# Altium schematic sheet etb_driver.SchDoc
size A4; SheetNumber: 4; SheetTotal: 8
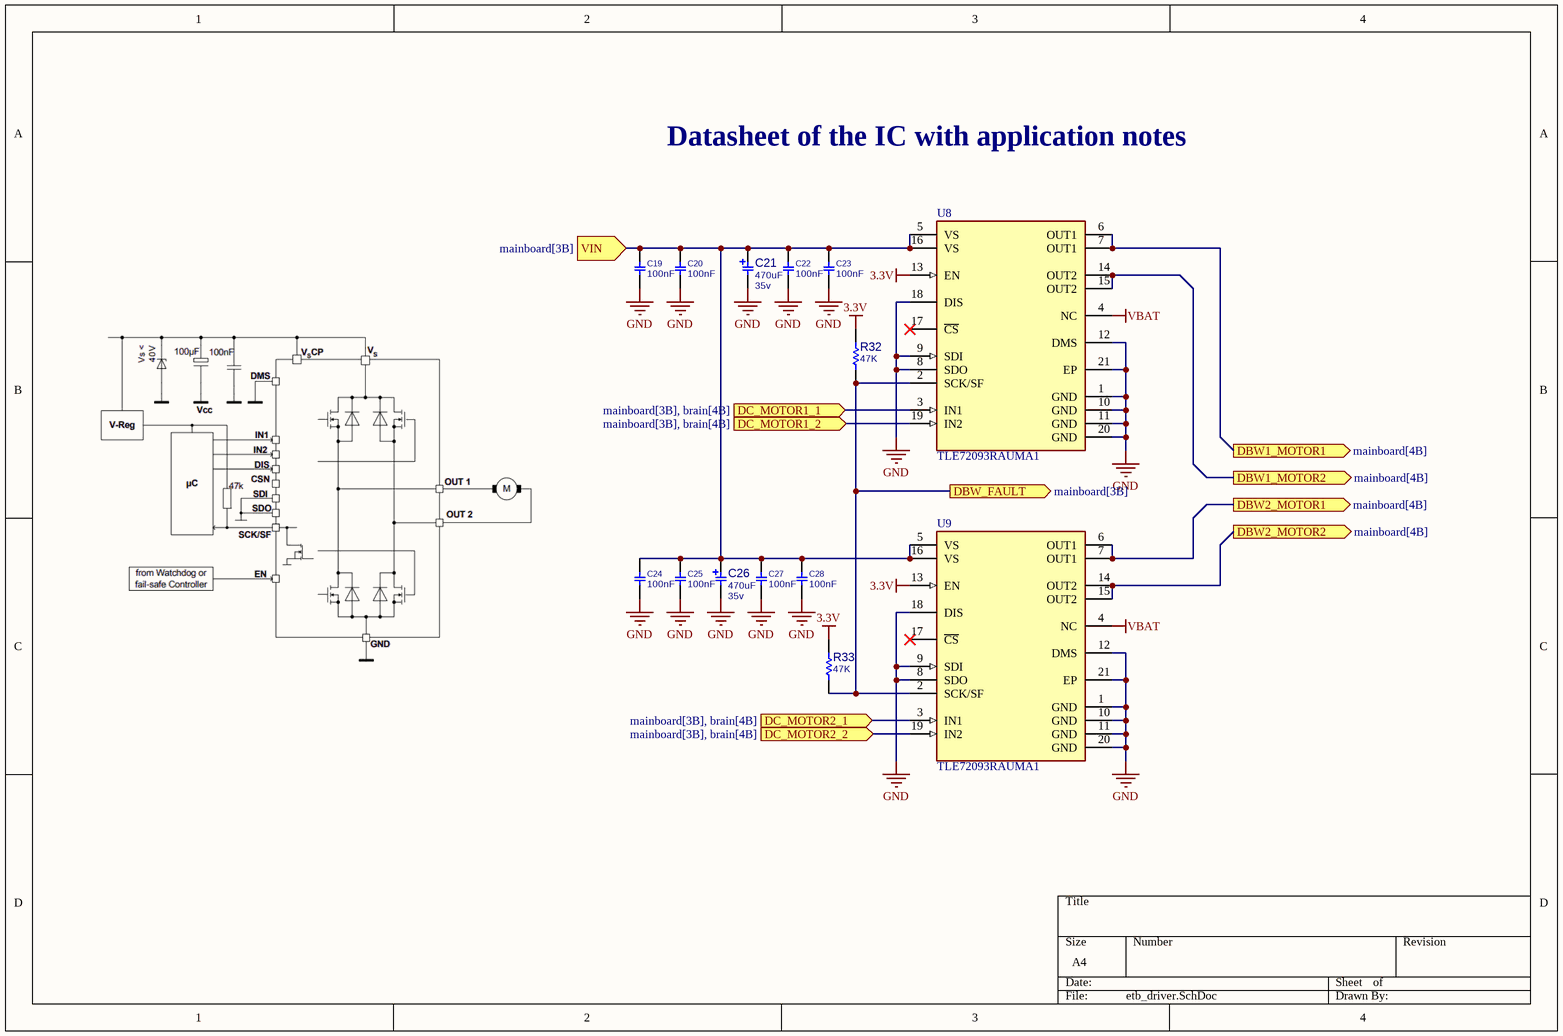
[diagram p0: etb_driver.SchDoc]

## Parts
C19  100nF  [C1206]
C20  100nF  [C1206]
C21  PARAM2: 35v  [C_EL_D10L10]  (hidden comment: 470uF)
C22  100nF  [C1206]
C23  100nF  [C1206]
C24  100nF  [C1206]
C25  100nF  [C1206]
C26  PARAM2: 35v  [C_EL_D10L10]  (hidden comment: 470uF)
C27  100nF  [C1206]
C28  100nF  [C1206]
R32  47K  [R0805]
R33  47K  [R0805]  (no BOM)
U8  TLE72093RAUMA1  [FP-PG-DSO-20-MFG]
U9  TLE72093RAUMA1  [FP-PG-DSO-20-MFG]

## Ports
DBW1_MOTOR1 (out, see mainboard[4B]), DBW1_MOTOR2 (out, see mainboard[4B]), DBW2_MOTOR1 (out, see mainboard[4B]), DBW2_MOTOR2 (out, see mainboard[4B]), DBW_FAULT (out, see mainboard[3B]), DC_MOTOR1_1 (in, see mainboard[3B], brain[4B]), DC_MOTOR1_2 (in, see mainboard[3B], brain[4B]), DC_MOTOR2_1 (in, see mainboard[3B], brain[4B]), DC_MOTOR2_2 (in, see mainboard[3B], brain[4B]), VIN (in, see mainboard[3B])

## Nets
3.3V: R32.2 R33.2 U8.13(EN) U9.13(EN)
GND: C19.1 C20.1 C21.2 C22.1 C23.1 C24.1 C25.1 C26.2 C27.1 C28.1 U8.1(GND) U8.8(SDO) U8.9(SDI) U8.10(GND) U8.11(GND) U8.12(DMS) U8.18(DIS) U8.20(GND) U8.21(EP) U9.1(GND) U9.8(SDO) U9.9(SDI) U9.10(GND) U9.11(GND) U9.12(DMS) U9.18(DIS) U9.20(GND) U9.21(EP)
VBAT: U8.4(NC) U9.4(NC)
DBW1_MOTOR1: U8.6(OUT1) U8.7(OUT1) ; port DBW1_MOTOR1
DBW1_MOTOR2: U8.14(OUT2) U8.15(OUT2) ; port DBW1_MOTOR2
DBW2_MOTOR1: U9.6(OUT1) U9.7(OUT1) ; port DBW2_MOTOR1
DBW2_MOTOR2: U9.14(OUT2) U9.15(OUT2) ; port DBW2_MOTOR2
DBW_FAULT: R32.1 R33.1 U8.2(SCK/SF) U9.2(SCK/SF) ; port DBW_FAULT
DC_MOTOR1_1: U8.3(IN1) ; port DC_MOTOR1_1
DC_MOTOR1_2: U8.19(IN2) ; port DC_MOTOR1_2
DC_MOTOR2_1: U9.3(IN1) ; port DC_MOTOR2_1
DC_MOTOR2_2: U9.19(IN2) ; port DC_MOTOR2_2
VIN: C19.2 C20.2 C21.1 C22.2 C23.2 C24.2 C25.2 C26.1 C27.2 C28.2 U8.5(VS) U8.16(VS) U9.5(VS) U9.16(VS) ; port VIN

Not connected (* = marked no-connect by the designer): U8 17(~{CS})*; U9 17(~{CS})*

## Notes on the sheet
- Datasheet of the IC with application notes <https://www.infineon.com/dgdl/Infineon-TLE7209_2R-DS-v01_05-en.pdf?fileId=db3a30431f848401011fc76ca8e77a06>

## Library data of the parts
C19 C20 C22-C25 C27 C28 = CAP_SMD_MLCC_1206: CAP, MLCC; PARAM: -, -%; MANF_P#: MANF_PART#; PARAM2: -V; PRICE: 100= 1$; MANF: -; ASSEMBLY: ASSEMBLY; VALUE: 100nF
C21 C26 = CAP_SMD_EL_470uF_35v: CAP, SMD, ELEC,; MANF_P#: MANF_PART#; DESC: DESCRIPTION; DIST#: MOUSER; PARAM: 20%; PRICE: 10= -$; MANF: MANF; ASSEMBLY: ASSEMBLY; VALUE: 470uF
R32 R33 = RES_SMD_0805: RESISTOR, SMD; PARAM: -W; DESC: DESCRIPTION; DIST#: MOUSER; PARAM2: 1%; MANF_P#: -; MANF: -; ASSEMBLY: ASSEMBLY; PRICE: 100= 0.5$; VALUE: 47K
U8 U9 = TLE7209: IC MOTOR DRIVER 3.5V-5.5V 20DSO; Logic Function: AND GATE; Max Supply Voltage: 28V; Output Current: 5A; Interface: SPI; RoHS Compliant: Yes; Lead Free: Contains Lead; Series: -; Max Operating Temperature: 150°C; Packaging: Tape and Reel; Mount: Surface Mount; Halogen Free: Halogen Free; Min Operating Temperature: -40°C